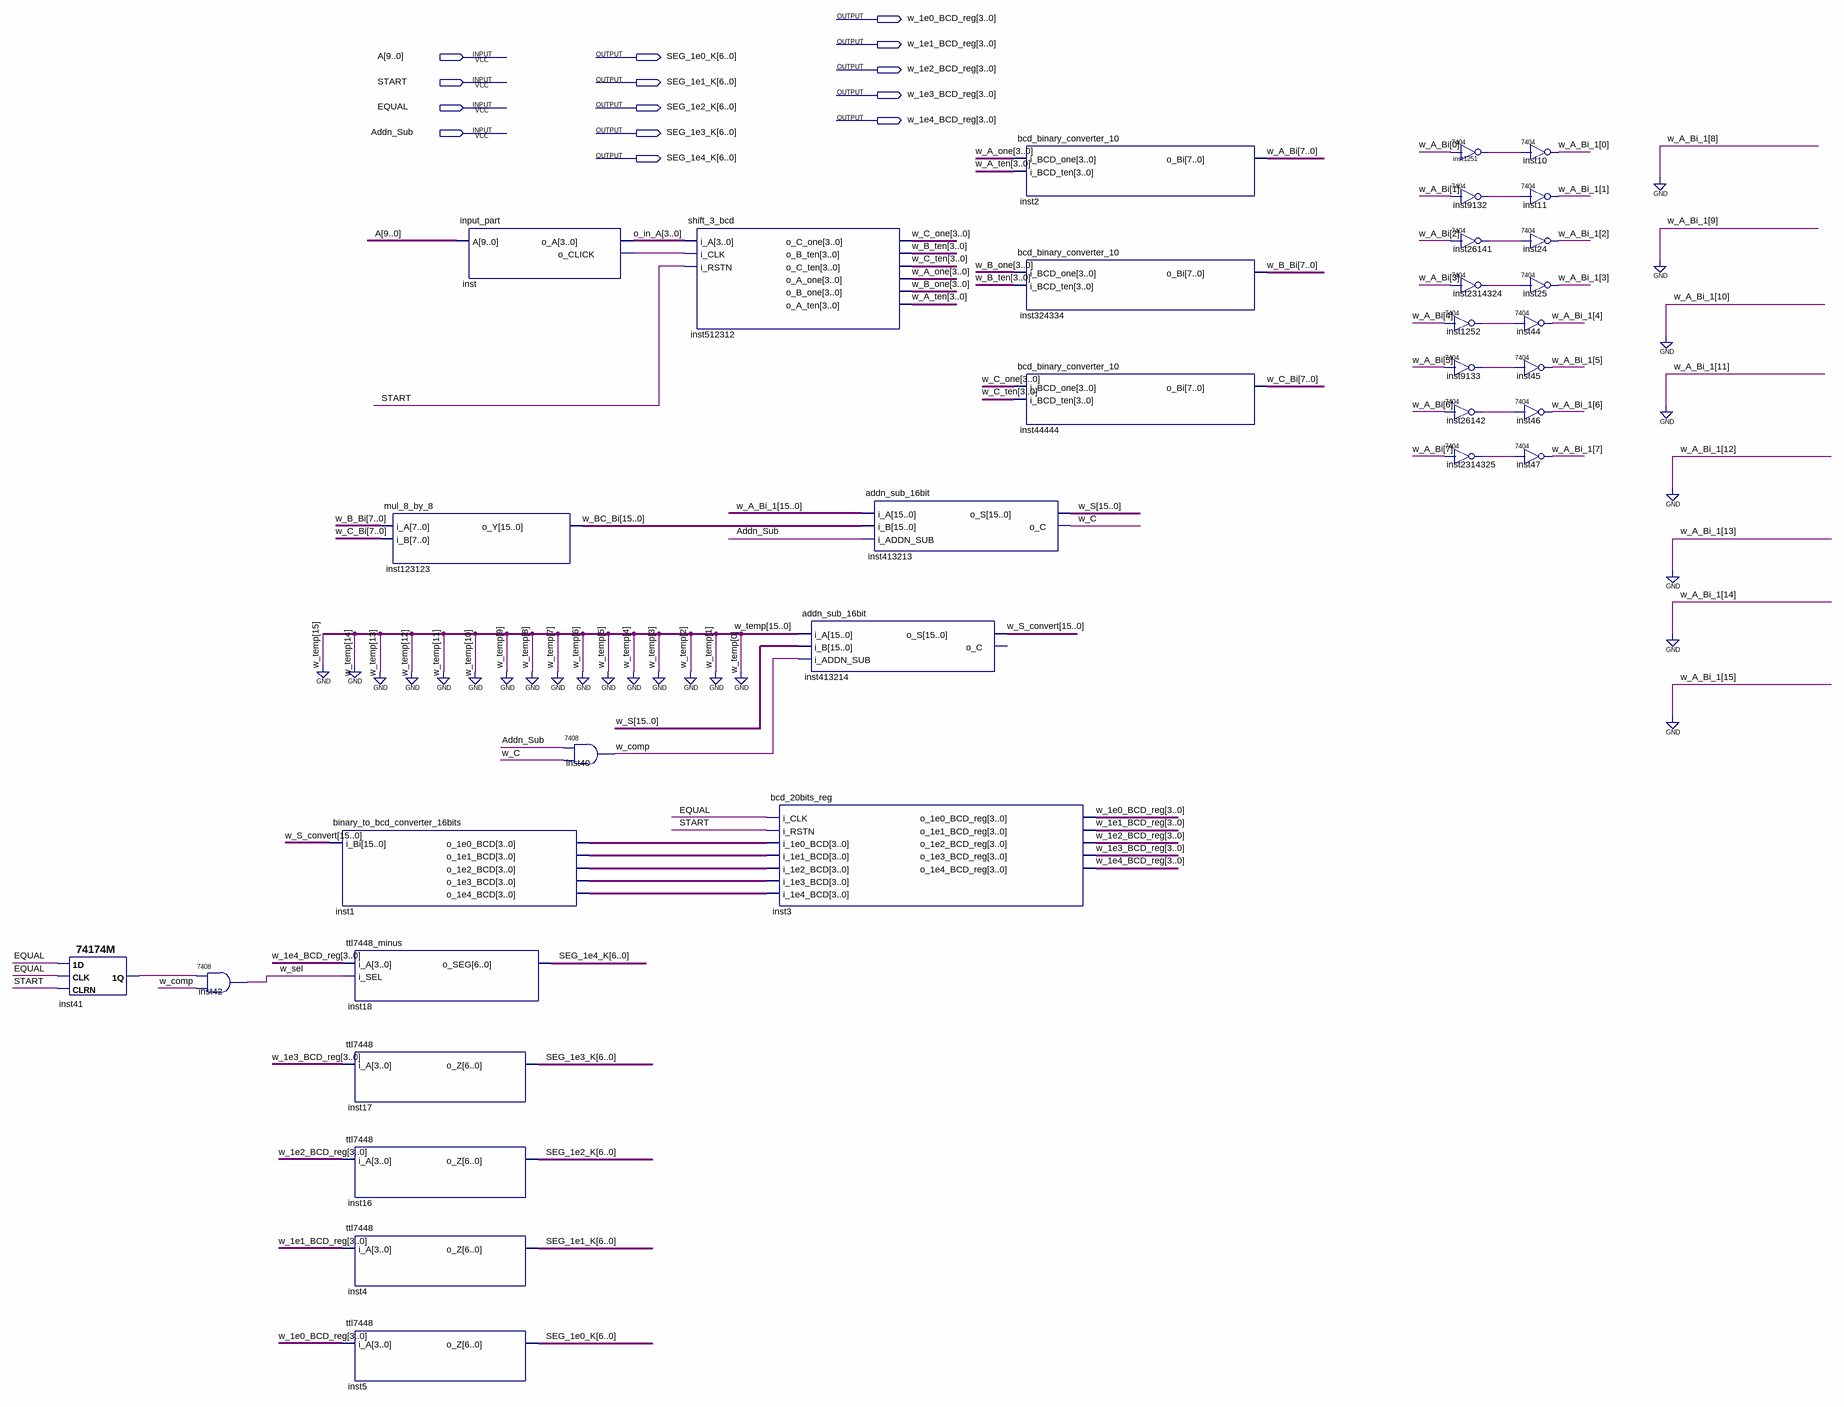
[diagram p0: schematic sheet]
// Quartus schematic top.bdf as structural Verilog: 34 symbols, 14 pins
module top (
  input  [9:0] A,
  input  START,
  input  EQUAL,
  input  Addn_Sub,
  output [3:0] w_1e0_BCD_reg,
  output [3:0] w_1e1_BCD_reg,
  output [6:0] SEG_1e0_K,
  output [3:0] w_1e2_BCD_reg,
  output [6:0] SEG_1e1_K,
  output [3:0] w_1e3_BCD_reg,
  output [6:0] SEG_1e2_K,
  output [3:0] w_1e4_BCD_reg,
  output [6:0] SEG_1e3_K,
  output [6:0] SEG_1e4_K
);

  wire inst41_1q, inst1251_1, inst1252_1, inst9132_1, inst9133_1, inst26141_1, inst26142_1, inst2314324_1,
       inst2314325_1, inst_o_click, w_C, w_comp, w_sel;
  wire [3:0] inst1_o_1e0_bcd, inst1_o_1e1_bcd, inst1_o_1e2_bcd, inst1_o_1e3_bcd, inst1_o_1e4_bcd, o_in_A,
       w_A_one, w_A_ten, w_B_one, w_B_ten, w_C_one, w_C_ten;
  wire [7:0] w_A_Bi, w_A_Bi_1, w_B_Bi, w_C_Bi;
  wire [15:0] w_BC_Bi, w_S, w_S_convert;

  \74174M  inst41 (.CLRN(START), .CLK(EQUAL), .\1D (EQUAL), .\1Q (inst41_1q));
  \7408  inst42 (.\3 (w_comp), .\2 (inst41_1q), .\1 (w_sel));
  binary_to_bcd_converter_16bits inst1 (
    .i_Bi(w_S_convert), .o_1e0_BCD(inst1_o_1e0_bcd), .o_1e1_BCD(inst1_o_1e1_bcd),
    .o_1e2_BCD(inst1_o_1e2_bcd), .o_1e3_BCD(inst1_o_1e3_bcd), .o_1e4_BCD(inst1_o_1e4_bcd));
  mul_8_by_8 inst123123 (.i_A(w_B_Bi), .i_B(w_C_Bi), .o_Y(w_BC_Bi));
  ttl7448_minus inst18 (.i_A(w_1e4_BCD_reg), .i_SEL(w_sel), .o_SEG(SEG_1e4_K));
  ttl7448 inst17 (.i_A(w_1e3_BCD_reg), .o_Z(SEG_1e3_K));
  ttl7448 inst16 (.i_A(w_1e2_BCD_reg), .o_Z(SEG_1e2_K));
  ttl7448 inst4 (.i_A(w_1e1_BCD_reg), .o_Z(SEG_1e1_K));
  ttl7448 inst5 (.i_A(w_1e0_BCD_reg), .o_Z(SEG_1e0_K));
  input_part inst (.A(A), .o_A(o_in_A), .o_CLICK(inst_o_click));
  \7408  inst40 (.\3 (w_C), .\2 (Addn_Sub), .\1 (w_comp));
  shift_3_bcd inst512312 (
    .i_A(o_in_A), .i_CLK(inst_o_click), .i_RSTN(START), .o_C_one(w_C_one), .o_B_ten(w_B_ten),
    .o_C_ten(w_C_ten), .o_A_one(w_A_one), .o_B_one(w_B_one), .o_A_ten(w_A_ten));
  bcd_20bits_reg inst3 (
    .i_CLK(EQUAL), .i_RSTN(START), .i_1e0_BCD(inst1_o_1e0_bcd), .i_1e1_BCD(inst1_o_1e1_bcd),
    .i_1e2_BCD(inst1_o_1e2_bcd), .i_1e3_BCD(inst1_o_1e3_bcd), .i_1e4_BCD(inst1_o_1e4_bcd),
    .o_1e0_BCD_reg(w_1e0_BCD_reg), .o_1e1_BCD_reg(w_1e1_BCD_reg), .o_1e2_BCD_reg(w_1e2_BCD_reg),
    .o_1e3_BCD_reg(w_1e3_BCD_reg), .o_1e4_BCD_reg(w_1e4_BCD_reg));
  addn_sub_16bit inst413214 (.i_A({16{1'b0}}), .i_B(w_S), .i_ADDN_SUB(w_comp), .o_S(w_S_convert));  // open: o_C
  addn_sub_16bit inst413213 (.i_A({{8{1'b0}}, w_A_Bi_1}), .i_B(w_BC_Bi), .i_ADDN_SUB(Addn_Sub), .o_S(w_S), .o_C(w_C));
  bcd_binary_converter_10 inst2 (.i_BCD_one(w_A_one), .i_BCD_ten(w_A_ten), .o_Bi(w_A_Bi));
  bcd_binary_converter_10 inst324334 (.i_BCD_one(w_B_one), .i_BCD_ten(w_B_ten), .o_Bi(w_B_Bi));
  bcd_binary_converter_10 inst44444 (.i_BCD_one(w_C_one), .i_BCD_ten(w_C_ten), .o_Bi(w_C_Bi));
  \7404  inst1251 (.\2 (w_A_Bi[0]), .\1 (inst1251_1));
  \7404  inst9132 (.\2 (w_A_Bi[1]), .\1 (inst9132_1));
  \7404  inst26141 (.\2 (w_A_Bi[2]), .\1 (inst26141_1));
  \7404  inst2314324 (.\2 (w_A_Bi[3]), .\1 (inst2314324_1));
  \7404  inst1252 (.\2 (w_A_Bi[4]), .\1 (inst1252_1));
  \7404  inst9133 (.\2 (w_A_Bi[5]), .\1 (inst9133_1));
  \7404  inst26142 (.\2 (w_A_Bi[6]), .\1 (inst26142_1));
  \7404  inst2314325 (.\2 (w_A_Bi[7]), .\1 (inst2314325_1));
  \7404  inst10 (.\2 (inst1251_1), .\1 (w_A_Bi_1[0]));
  \7404  inst11 (.\2 (inst9132_1), .\1 (w_A_Bi_1[1]));
  \7404  inst24 (.\2 (inst26141_1), .\1 (w_A_Bi_1[2]));
  \7404  inst25 (.\2 (inst2314324_1), .\1 (w_A_Bi_1[3]));
  \7404  inst44 (.\2 (inst1252_1), .\1 (w_A_Bi_1[4]));
  \7404  inst45 (.\2 (inst9133_1), .\1 (w_A_Bi_1[5]));
  \7404  inst46 (.\2 (inst26142_1), .\1 (w_A_Bi_1[6]));
  \7404  inst47 (.\2 (inst2314325_1), .\1 (w_A_Bi_1[7]));
endmodule
